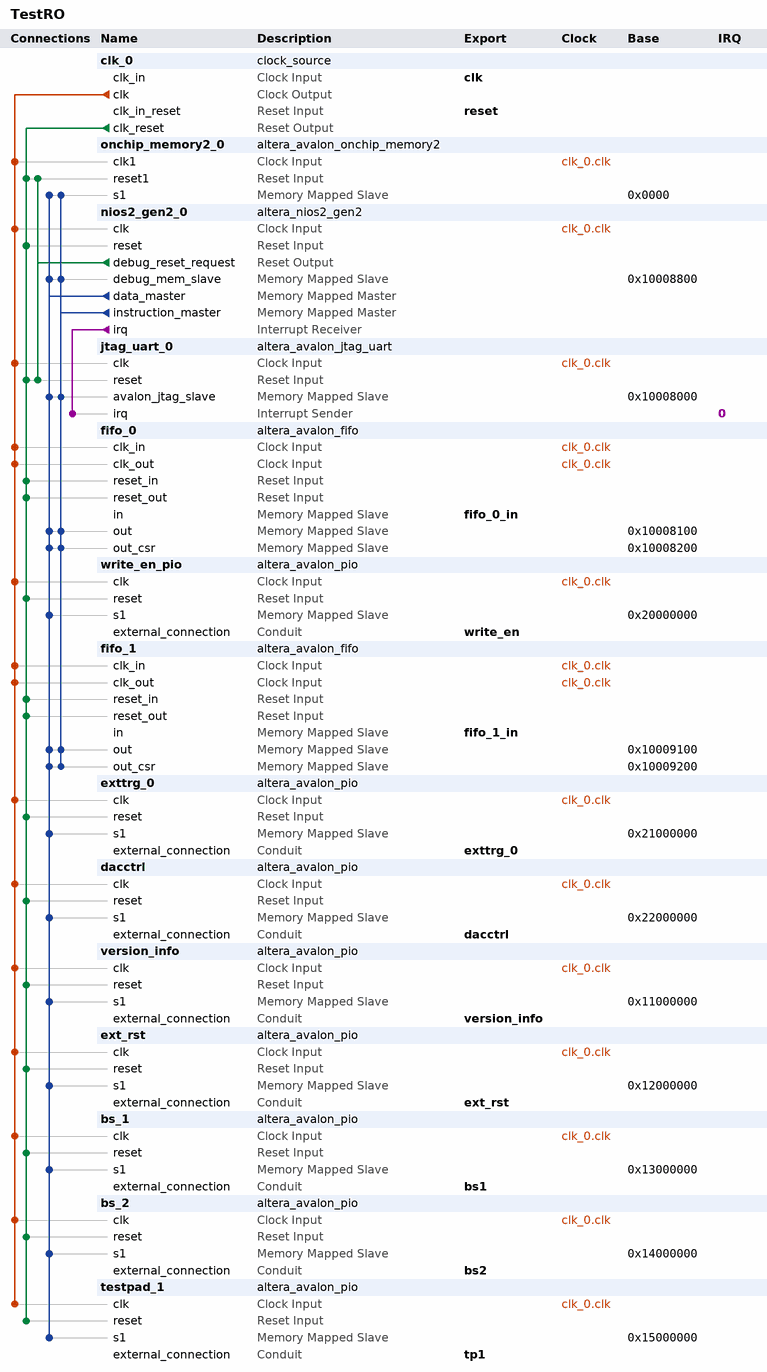
[diagram p0: system contents]
# Platform Designer (Qsys) system TestRO, Cyclone V 5CEFA7F23I7
# Parameters at their usual value, and those the tool derives, are not listed.
package require -exact qsys 18.0
create_system TestRO
set_project_property DEVICE_FAMILY {Cyclone V}
set_project_property DEVICE 5CEFA7F23I7

add_instance clk_0 clock_source 18.0
set_instance_parameter_value clk_0 clockFrequency 100000000

add_instance onchip_memory2_0 altera_avalon_onchip_memory2 18.0
set_instance_parameter_value onchip_memory2_0 dataWidth 128
set_instance_parameter_value onchip_memory2_0 dualPort false
set_instance_parameter_value onchip_memory2_0 initMemContent true
set_instance_parameter_value onchip_memory2_0 initializationFileName onchip_mem.hex
set_instance_parameter_value onchip_memory2_0 memorySize 300000

add_instance nios2_gen2_0 altera_nios2_gen2 18.0
set_instance_parameter_value nios2_gen2_0 dcache_size 2048
set_instance_parameter_value nios2_gen2_0 exceptionSlave onchip_memory2_0.s1
set_instance_parameter_value nios2_gen2_0 icache_size 4096
set_instance_parameter_value nios2_gen2_0 impl Tiny
set_instance_parameter_value nios2_gen2_0 resetSlave onchip_memory2_0.s1

add_instance jtag_uart_0 altera_avalon_jtag_uart 18.0
set_instance_parameter_value jtag_uart_0 simInteractiveOptions NO_INTERACTIVE_WINDOWS

add_instance fifo_0 altera_avalon_fifo 18.0
set_instance_parameter_value fifo_0 bitsPerSymbol 16
set_instance_parameter_value fifo_0 channelWidth 8
set_instance_parameter_value fifo_0 errorWidth 8
set_instance_parameter_value fifo_0 fifoDepth 4096
set_instance_parameter_value fifo_0 fifoInputInterfaceOptions AVALONMM_WRITE
set_instance_parameter_value fifo_0 fifoOutputInterfaceOptions AVALONMM_READ
set_instance_parameter_value fifo_0 singleClockMode false
set_instance_parameter_value fifo_0 symbolsPerBeat 2
set_instance_parameter_value fifo_0 useIRQ false
set_instance_parameter_value fifo_0 usePacket true
set_instance_parameter_value fifo_0 useReadControl true
set_instance_parameter_value fifo_0 useWriteControl false

add_instance write_en_pio altera_avalon_pio 18.0
set_instance_parameter_value write_en_pio direction Output
set_instance_parameter_value write_en_pio width 1

add_instance fifo_1 altera_avalon_fifo 18.0
set_instance_parameter_value fifo_1 bitsPerSymbol 16
set_instance_parameter_value fifo_1 channelWidth 8
set_instance_parameter_value fifo_1 errorWidth 8
set_instance_parameter_value fifo_1 fifoDepth 4096
set_instance_parameter_value fifo_1 fifoInputInterfaceOptions AVALONMM_WRITE
set_instance_parameter_value fifo_1 fifoOutputInterfaceOptions AVALONMM_READ
set_instance_parameter_value fifo_1 singleClockMode false
set_instance_parameter_value fifo_1 symbolsPerBeat 2
set_instance_parameter_value fifo_1 useIRQ false
set_instance_parameter_value fifo_1 usePacket true
set_instance_parameter_value fifo_1 useReadControl true
set_instance_parameter_value fifo_1 useWriteControl false

add_instance exttrg_0 altera_avalon_pio 18.0
set_instance_parameter_value exttrg_0 direction Output
set_instance_parameter_value exttrg_0 width 1

add_instance dacctrl altera_avalon_pio 18.0
set_instance_parameter_value dacctrl direction Output
set_instance_parameter_value dacctrl width 32

add_instance version_info altera_avalon_pio 18.0
set_instance_parameter_value version_info direction Input
set_instance_parameter_value version_info width 32

add_instance ext_rst altera_avalon_pio 18.0
set_instance_parameter_value ext_rst direction Output
set_instance_parameter_value ext_rst width 1

add_instance bs_1 altera_avalon_pio 18.0
set_instance_parameter_value bs_1 direction Input
set_instance_parameter_value bs_1 width 14

add_instance bs_2 altera_avalon_pio 18.0
set_instance_parameter_value bs_2 direction Input
set_instance_parameter_value bs_2 width 14

add_instance testpad_1 altera_avalon_pio 18.0
set_instance_parameter_value testpad_1 direction Input
set_instance_parameter_value testpad_1 width 14

# connections
add_connection clk_0.clk bs_1.clk clock
add_connection clk_0.clk bs_2.clk clock
add_connection clk_0.clk dacctrl.clk clock
add_connection clk_0.clk ext_rst.clk clock
add_connection clk_0.clk exttrg_0.clk clock
add_connection clk_0.clk fifo_0.clk_in clock
add_connection clk_0.clk fifo_0.clk_out clock
add_connection clk_0.clk fifo_1.clk_in clock
add_connection clk_0.clk fifo_1.clk_out clock
add_connection clk_0.clk jtag_uart_0.clk clock
add_connection clk_0.clk nios2_gen2_0.clk clock
add_connection clk_0.clk onchip_memory2_0.clk1 clock
add_connection clk_0.clk testpad_1.clk clock
add_connection clk_0.clk version_info.clk clock
add_connection clk_0.clk write_en_pio.clk clock
add_connection clk_0.clk_reset bs_1.reset reset
add_connection clk_0.clk_reset bs_2.reset reset
add_connection clk_0.clk_reset dacctrl.reset reset
add_connection clk_0.clk_reset ext_rst.reset reset
add_connection clk_0.clk_reset exttrg_0.reset reset
add_connection clk_0.clk_reset fifo_0.reset_in reset
add_connection clk_0.clk_reset fifo_0.reset_out reset
add_connection clk_0.clk_reset fifo_1.reset_in reset
add_connection clk_0.clk_reset fifo_1.reset_out reset
add_connection clk_0.clk_reset jtag_uart_0.reset reset
add_connection clk_0.clk_reset nios2_gen2_0.reset reset
add_connection clk_0.clk_reset onchip_memory2_0.reset1 reset
add_connection clk_0.clk_reset testpad_1.reset reset
add_connection clk_0.clk_reset version_info.reset reset
add_connection clk_0.clk_reset write_en_pio.reset reset
add_connection nios2_gen2_0.debug_reset_request jtag_uart_0.reset reset
add_connection nios2_gen2_0.debug_reset_request onchip_memory2_0.reset1 reset
add_connection nios2_gen2_0.data_master bs_1.s1 avalon
set_connection_parameter_value nios2_gen2_0.data_master/bs_1.s1 baseAddress 0x13000000
add_connection nios2_gen2_0.data_master bs_2.s1 avalon
set_connection_parameter_value nios2_gen2_0.data_master/bs_2.s1 baseAddress 0x14000000
add_connection nios2_gen2_0.data_master dacctrl.s1 avalon
set_connection_parameter_value nios2_gen2_0.data_master/dacctrl.s1 baseAddress 0x22000000
add_connection nios2_gen2_0.data_master ext_rst.s1 avalon
set_connection_parameter_value nios2_gen2_0.data_master/ext_rst.s1 baseAddress 0x12000000
add_connection nios2_gen2_0.data_master exttrg_0.s1 avalon
set_connection_parameter_value nios2_gen2_0.data_master/exttrg_0.s1 baseAddress 0x21000000
add_connection nios2_gen2_0.data_master fifo_0.out avalon
set_connection_parameter_value nios2_gen2_0.data_master/fifo_0.out baseAddress 0x10008100
add_connection nios2_gen2_0.data_master fifo_0.out_csr avalon
set_connection_parameter_value nios2_gen2_0.data_master/fifo_0.out_csr baseAddress 0x10008200
add_connection nios2_gen2_0.data_master fifo_1.out avalon
set_connection_parameter_value nios2_gen2_0.data_master/fifo_1.out baseAddress 0x10009100
add_connection nios2_gen2_0.data_master fifo_1.out_csr avalon
set_connection_parameter_value nios2_gen2_0.data_master/fifo_1.out_csr baseAddress 0x10009200
add_connection nios2_gen2_0.data_master jtag_uart_0.avalon_jtag_slave avalon
set_connection_parameter_value nios2_gen2_0.data_master/jtag_uart_0.avalon_jtag_slave baseAddress 0x10008000
add_connection nios2_gen2_0.data_master nios2_gen2_0.debug_mem_slave avalon
set_connection_parameter_value nios2_gen2_0.data_master/nios2_gen2_0.debug_mem_slave baseAddress 0x10008800
add_connection nios2_gen2_0.data_master onchip_memory2_0.s1 avalon
set_connection_parameter_value nios2_gen2_0.data_master/onchip_memory2_0.s1 baseAddress 0x0000
add_connection nios2_gen2_0.data_master testpad_1.s1 avalon
set_connection_parameter_value nios2_gen2_0.data_master/testpad_1.s1 baseAddress 0x15000000
add_connection nios2_gen2_0.data_master version_info.s1 avalon
set_connection_parameter_value nios2_gen2_0.data_master/version_info.s1 baseAddress 0x11000000
add_connection nios2_gen2_0.data_master write_en_pio.s1 avalon
set_connection_parameter_value nios2_gen2_0.data_master/write_en_pio.s1 baseAddress 0x20000000
add_connection nios2_gen2_0.instruction_master fifo_0.out avalon
set_connection_parameter_value nios2_gen2_0.instruction_master/fifo_0.out baseAddress 0x10008100
add_connection nios2_gen2_0.instruction_master fifo_0.out_csr avalon
set_connection_parameter_value nios2_gen2_0.instruction_master/fifo_0.out_csr baseAddress 0x10008200
add_connection nios2_gen2_0.instruction_master fifo_1.out avalon
set_connection_parameter_value nios2_gen2_0.instruction_master/fifo_1.out baseAddress 0x10009100
add_connection nios2_gen2_0.instruction_master fifo_1.out_csr avalon
set_connection_parameter_value nios2_gen2_0.instruction_master/fifo_1.out_csr baseAddress 0x10009200
add_connection nios2_gen2_0.instruction_master jtag_uart_0.avalon_jtag_slave avalon
set_connection_parameter_value nios2_gen2_0.instruction_master/jtag_uart_0.avalon_jtag_slave baseAddress 0x10008000
add_connection nios2_gen2_0.instruction_master nios2_gen2_0.debug_mem_slave avalon
set_connection_parameter_value nios2_gen2_0.instruction_master/nios2_gen2_0.debug_mem_slave baseAddress 0x10008800
add_connection nios2_gen2_0.instruction_master onchip_memory2_0.s1 avalon
set_connection_parameter_value nios2_gen2_0.instruction_master/onchip_memory2_0.s1 baseAddress 0x0000
add_connection nios2_gen2_0.irq jtag_uart_0.irq interrupt
set_connection_parameter_value nios2_gen2_0.irq/jtag_uart_0.irq irqNumber 0

# exported interfaces
add_interface bs1 conduit end
set_interface_property bs1 EXPORT_OF bs_1.external_connection
add_interface bs2 conduit end
set_interface_property bs2 EXPORT_OF bs_2.external_connection
add_interface clk clock sink
set_interface_property clk EXPORT_OF clk_0.clk_in
add_interface dacctrl conduit end
set_interface_property dacctrl EXPORT_OF dacctrl.external_connection
add_interface ext_rst conduit end
set_interface_property ext_rst EXPORT_OF ext_rst.external_connection
add_interface exttrg_0 conduit end
set_interface_property exttrg_0 EXPORT_OF exttrg_0.external_connection
add_interface fifo_0_in avalon slave
set_interface_property fifo_0_in EXPORT_OF fifo_0.in
add_interface fifo_1_in avalon slave
set_interface_property fifo_1_in EXPORT_OF fifo_1.in
add_interface reset reset sink
set_interface_property reset EXPORT_OF clk_0.clk_in_reset
add_interface tp1 conduit end
set_interface_property tp1 EXPORT_OF testpad_1.external_connection
add_interface version_info conduit end
set_interface_property version_info EXPORT_OF version_info.external_connection
add_interface write_en conduit end
set_interface_property write_en EXPORT_OF write_en_pio.external_connection

set_interconnect_requirement {$system} qsys_mm.clockCrossingAdapter HANDSHAKE
set_interconnect_requirement {$system} qsys_mm.enableEccProtection FALSE
set_interconnect_requirement {$system} qsys_mm.insertDefaultSlave FALSE
set_interconnect_requirement {$system} qsys_mm.maxAdditionalLatency 1

save_system TestRO.qsys
